# EAGLE design v2.0_r1 (EAGLE 9.6.2)
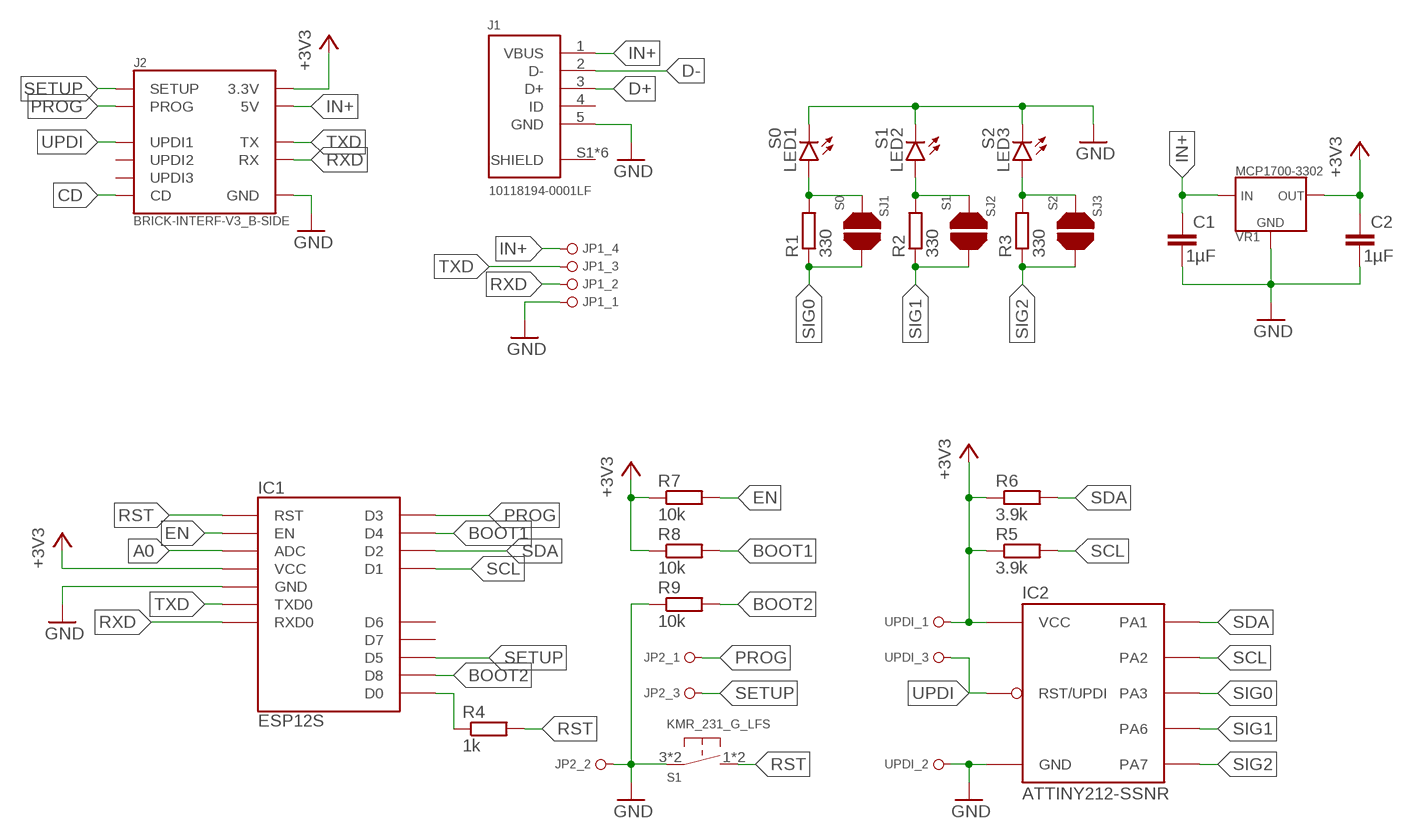
[diagram p0: schematic, sheet 1]

## Parts
C1  1µF  C-EUC0805  [C0805]
C2  1µF  C-EUC0805  [C0805]
IC1  ESP12S  [ESP12S]
IC2  ATTINY212-SSNR  [SOIC8]
J1  10118194-0001LF  [10118194-0001LF]
J2  BRICK-INTERF-V3_B-SIDE  [DF9-11P-1V(32)]
JP1  PINHD_1X04_R_1  [1X04_R_1]
JP2  PINHD_1X03_R_1  [1X03_R_1]
LED1  S0  LED5MM  [LED5MM]
LED2  S1  LED5MM  [LED5MM]
LED3  S2  LED5MM  [LED5MM]
R1  330  R-EU_R0603  [R0603]
R2  330  R-EU_R0603  [R0603]
R3  330  R-EU_R0603  [R0603]
R4  1k  R-EU_R0805  [R0805]
R5  3.9k  R-EU_R0805  [R0805]
R6  3.9k  R-EU_R0805  [R0805]
R7  10k  R-EU_R0805  [R0805]
R8  10k  R-EU_R0805  [R0805]
R9  10k  R-EU_R0805  [R0805]
S1  KMR_231_G_LFS  [KMR_231_G_LFS]
SJ1  S0  SOLDERJUMPER  [SOLDERJUMPER]
SJ2  S1  SOLDERJUMPER  [SOLDERJUMPER]
SJ3  S2  SOLDERJUMPER  [SOLDERJUMPER]
UPDI  PINHD_1X03_R_1  [1X03_R_1]
VR1  MCP1700-3302  [SOT23]

## Nets
+3V3: C2.1 IC1.VCC IC2.1(VCC) J2.10(3.3V) R5.1 R6.1 R7.1 R8.1 UPDI.1 VR1.2(OUT)
A0: IC1.ADC
BOOT1: IC1.GPIO2(D4) R8.2
BOOT2: IC1.GPIO15(D8) R9.2
CD: J2.5(CD)
D+: J1.3(D+)
D-: J1.2(D-)
EN: IC1.EN R7.2
GND: C1.2 C2.2 IC1.GND IC2.8(GND) J1.5(GND) J2.6(GND) JP1.1 JP2.2 LED1.K(C) LED2.K(C) LED3.K(C) R9.1 S1.3 S1.4 UPDI.2 VR1.1(GND)
IN+: C1.1 J1.1(VBUS) J2.4(5V) JP1.4 VR1.3(IN)
N$5: LED1.A R1.2 SJ1.1
N$6: LED2.A R2.2 SJ2.1
N$9: LED3.A R3.2 SJ3.1
PROG: IC1.GPIO0(D3) J2.3(PROG) JP2.1
RST: IC1.RST R4.2 S1.1 S1.2
RXD: IC1.RXD0 J2.11(RX) JP1.2
SCL: IC1.GPIO5(D1) IC2.5(PA2) R5.2
SDA: IC1.GPIO4(D2) IC2.4(PA1) R6.2
SETUP: IC1.GPIO14(D5) J2.2(SETUP) JP2.3
SIG0: IC2.7(PA3) R1.1 SJ1.2
SIG1: IC2.2(PA6) R2.1 SJ2.2
SIG2: IC2.3(PA7) R3.1 SJ3.2
TXD: IC1.TXD0 J2.1(TX) JP1.3
UPDI: IC2.6(RST/UPDI) J2.7(UPDI1) UPDI.3
WAKE: IC1.GPIO16(D0) R4.1
Unconnected: IC1.GPIO12(D6) IC1.GPIO13(D7) J1.4(ID) J2.8(UPDI2) J2.9(UPDI3)

## Power pins joined to a net without a drawn wire
SHIELD: J1.S1(SHIELD) J1.S2(SHIELD) J1.S3(SHIELD) J1.S4(SHIELD) J1.S5(SHIELD) J1.S6(SHIELD)

## Library data of the parts
C1 C2 = rcl:C-EU: CAPACITOR, European symbol; SPICEPREFIX: C
IC1 = no_expressif:ESP12S
IC2 = no_microchip:ATTINY212
J1 = no_reichelt:10118194-0001LF: CONN RCPT USB2.0 MICRO B SMD R/A Manufacturer's datasheet <https://www.amphenol-icc.com/media/wysiwyg/files/drawing/10118194.pdf?__cf_chl_jschl_tk__=1e9b4569481076e99900b246ea640525553a7b60-1588047333-0-AZhEk6D50lwOf6CdaXmV1teudqMKHMxqtb1pEtnUtu77sOc-OVRjbCmHdORomVnr0W49D2E8XkcMdJ2SdWt5rDDYIblyJz7fSv-zilM8vQKAQDC1Z9aMVORhnMgYjPDuz8XpfDLul_eaqqFpemo1xIgoZv50WTuLMwu26ci7e02s9PWvR3z1cDqm9GMGYIPwIUd9yh5-TtN_o6DbEkadC7zoJlhYZSw-VEaYzfWnBSFg_n44fbEB3slHLR2YKLSiTmh8RSwpxKUP4gER0KeVoie9w-Ibtx3oKQbsZjrsPLGSu9BzV2nf3QeoErALCQuycvY9WhQdebLIpxaon6SXufpVIIdoKZHRpjuVVlAkUIr9oSIZGQzzOWY1-dWY48jVEOvnvoxw9-xup5uFcr7XWo0>; CREATED_BY: PCBLayout.com; DIGIKEY_PARTNO: 609-4618-2-ND; MANUFACTURER: Amphenol ICC (FCI); MPN: 10118194-0001LF
J2 = no_brick_interface:BRICK-INTERF-V3
JP1 = no_pinhd:PINHD_1X04; DRILL: 1mm; PADSHAPE: round
JP2 UPDI = no_pinhd:PINHD_1X03; DRILL: 1mm; PADSHAPE: round
LED1-LED3 = led:LED: LED OSRAM: - CHIPLED LG R971, LG N971, LY N971, LG Q971, LY Q971, LO R971, LY R971 LH N974, LH R974 LS Q976, LO Q976, LY Q976 LO Q996 - Hyper CHIPLED LW Q18S LB Q993, LB Q99A, LB R99A - SideLED LS A670, LO A670, LY A670, LG A670, LP A670 LB A673, LV A673, LT A673, LW A673 LH A674 LY A675 LS A676, LA A676, LO A676, LY A676, LW A676 LS A679, LY A679, LG A679 - Hyper Micro SIDELED® LS Y876, LA Y876, LO Y876, LY Y876 LT Y87S - SmartLED LW L88C, LW L88S LB L89C, LB L89S, LG L890 LS L89K, LO L89K, LY L89K LS L896, LA L896, LO L896, LY L896 - TOPLED LS T670, LO T670, LY T670, LG T670, LP T670 LSG T670, LSP T670, LSY T670, LOP T670, LYG T670 LG T671, LOG T671, LSG T671 LB T673, LV T673, LT T673, LW T673 LH T674 LS T676, LA T676, LO T676, LY T676, LB T676, LH T676, LSB T676, LW T676 LB T67C, LV T67C, LT T67C, LS T67K, LO T67K, LY T67K, LW E67C LS E67B, LA E67B, LO E67B, LY E67B, LB E67C, LV E67C, LT E67C LW T67C LS T679, LY T679, LG T679 LS T770, LO T770, LY T770, LG T770, LP T770 LB T773, LV T773, LT T773, LW T773 LH T774 LS E675, LA E675, LY E675, LS T675 LS T776, LA T776, LO T776, LY T776, LB T776 LHGB T686 LT T68C, LB T68C - Hyper Mini TOPLED® LB M676 - Mini TOPLED Santana® LG M470 LS M47K, LO M47K, LY M47K Source: http://www.osram.convergy.de LUXEON: - LUMILED® LXK2-PW12-R00, LXK2-PW12-S00, LXK2-PW14-U00, LXK2-PW14-V00 LXK2-PM12-R00, LXK2-PM12-S00, LXK2-PM14-U00 LXK2-PE12-Q00, LXK2-PE12-R00, LXK2-PE12-S00, LXK2-PE14-T00, LXK2-PE14-U00 LXK2-PB12-K00, LXK2-PB12-L00, LXK2-PB12-M00, LXK2-PB14-N00, LXK2-PB14-P00, LXK2-PB14-Q00 LXK2-PR12-L00, LXK2-PR12-M00, LXK2-PR14-Q00, LXK2-PR14-R00 LXK2-PD12-Q00, LXK2-PD12-R00, LXK2-PD12-S00 LXK2-PH12-R00, LXK2-PH12-S00 LXK2-PL12-P00, LXK2-PL12-Q00, LXK2-PL12-R00 Source: www.luxeon.com KINGBRIGHT: KA-3528ASYC Source: www.kingbright.com
R1-R9 = rcl:R-EU_: RESISTOR, European symbol; SPICEPREFIX: R
S1 = no_reichelt:KMR_231_G_LFS
SJ1-SJ3 = no_pinhd:SOLDERJUMPER
VR1 = no_reichelt:MCP170

## Board
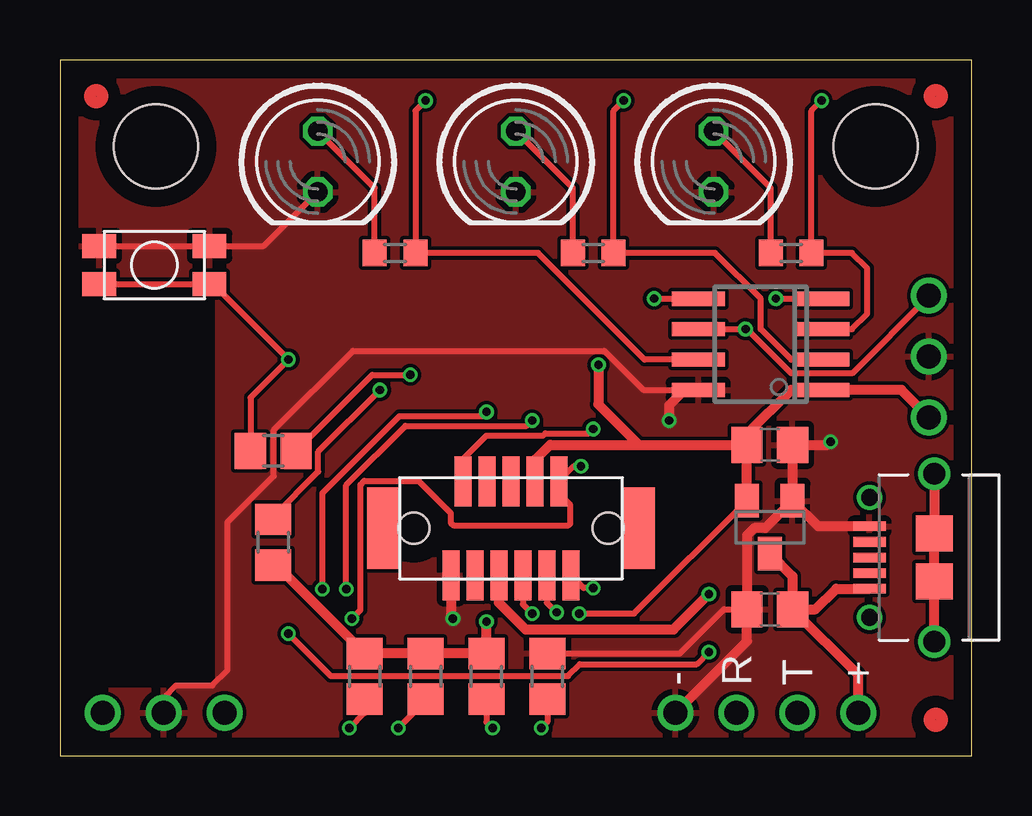
[diagram p1: board, top side]
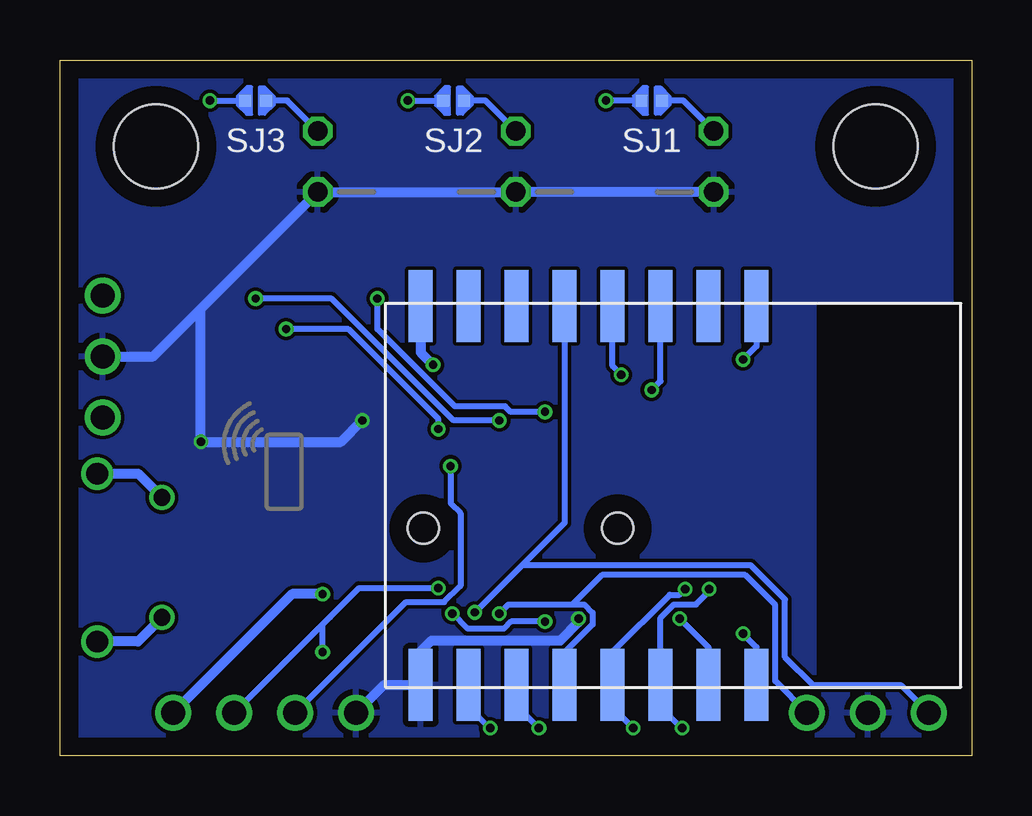
[diagram p2: board, bottom side, seen from below]

Size 38 x 29 mm. Coordinates in mm from the lower left corner, seen from the top.
Outline: 0,0 38,0 38,29 0,29 0,0
Copper layers (1*16): Top 0.035mm / dielectric 1.5mm / Bottom 0.035mm
Design rules "JLCPCB": minimum track width 6mil, minimum drill 0.2mm, track to track 6mil, track to pad 6mil, pad to pad 6mil, via to via 6mil, smd to smd 6mil, copper to edge 30mil, drill to drill 8mil, minimum pad ring 0.13mm, minimum via ring 0.13mm, stop-mask expansion 4mil, vias tented up to drill 0mil, thermal gap 10mil
Holes 3.5 mm at 34,25.4 4,25.4

### Footprints (pad centres in the part's own frame; a part is rotated, then mirrored left to right if it is on the bottom)
C0805 = smd 1.3 x 1.5: 1 -0.95,0; 2 0.95,0
ESP12S = smd 3 x 1: ADC -7.9,1.48; EN -7.9,-0.52; GND 7.9,-10.52; GPIO0 7.9,-4.52; GPIO2 7.9,-6.52; GPIO4 7.9,-2.52; GPIO5 7.9,-0.52; GPIO12 -7.9,-6.52; GPIO13 -7.9,-8.52; GPIO14 -7.9,-4.52; GPIO15 7.9,-8.52; GPIO16 -7.9,-2.52; RST -7.9,3.48; RXD0 7.9,1.48; TXD0 7.9,3.48; VCC -7.9,-10.52
SOIC8 = smd 0.6 x 2.2: 1 -1.905,-2.6; 2 -0.635,-2.6; 3 0.635,-2.6; 4 1.905,-2.6; 5 1.905,2.6; 6 0.635,2.6; 7 -0.635,2.6; 8 -1.905,2.6
10118194-0001LF = smd 0.4 x 1.35: 1 -1.3,2.7; 2 -0.65,2.7; 3 0,2.7; 4 0.65,2.7; 5 1.3,2.7 | drill 0.7: S1 -2.5,2.7; S2 2.5,2.7 | drill 0.9: S3 -3.5,0; S6 3.5,0 | smd 1.5 x 1.55: S4 -1,0; S5 1,0
DF9-11P-1V(32) = smd 0.7 x 2.08: 1 2.5,-1.96; 2 1.5,-1.96; 3 0.5,-1.96; 4 -0.5,-1.96; 5 -1.5,-1.96; 6 -2.5,-1.96; 7 -2,1.96; 8 -1,1.96; 9 0,1.96; 10 1,1.96; 11 2,1.96 | smd 1.3 x 3.4: S1 5.35,0; S2 -5.35,0 | hole 1.3: 4.05,0; -4.05,0
1X04_R_1 = drill 1: 1 -3.81,0; 2 -1.27,0; 3 1.27,0; 4 3.81,0
1X03_R_1 = drill 1: 1 -2.54,0; 2 0,0; 3 2.54,0
LED5MM = drill 0.813 octagon: A -1.27,0; K 1.27,0
R0603 = smd 1 x 1.1: 1 -0.85,0; 2 0.85,0
R0805 = smd 1.3 x 1.5: 1 -0.95,0; 2 0.95,0
KMR_231_G_LFS = smd 1 x 1.4: 1 -0.8,2.3; 2 -0.8,-2.3; 3 0.8,-2.3; 4 0.8,2.3
SOLDERJUMPER = smd 0.508 x 0.508: 1 -0.432,0; 2 0.432,0
SOT23 = smd 1 x 1.4: 1 -0.95,-1.1; 2 0.95,-1.1; 3 0,1.1

### Placement (x,y rotation side)
C1  29.59,6.1 180 top
C2  29.59,12.95 0 top
FD1  [FIDUCIAL]  1.5,27.5 0 top
FD2  [FIDUCIAL]  36.5,27.5 0 top
FD3  [FIDUCIAL]  36.5,1.5 0 top
IC1  12.45,10.85 270 bottom
IC2  29.21,17.14 90 top
J1  36.45,8.26 90 top
J2  18.8,9.47 0 top
JP1  29.46,1.78 0 top
JP2  4.32,1.78 180 top
LED1  10.74,24.77 270 top
LED2  19,24.77 270 top
LED3  27.25,24.77 270 top
R1  13.97,20.95 180 top
R2  22.23,20.95 180 top
R3  30.48,20.95 180 top
R4  8.89,12.7 180 top
R5  12.7,3.3 270 top
R6  15.24,3.3 270 top
R7  8.89,8.89 90 top
R8  17.78,3.3 270 top
R9  20.32,3.3 270 top
S1  3.94,20.45 90 top
SJ1  13.34,27.3 180 bottom
SJ2  21.59,27.3 180 bottom
SJ3  29.84,27.3 180 bottom
U$3  [BRICKS_LOGO_10]  26.04,6.73 90 bottom
UPDI  36.22,16.64 90 top
VR1  29.59,9.53 180 top

### Tracks (layer width: path | path; a pad name or v marks a point on that pad's centre or on a via)
+3V3  (via drill 0.35)
  Top 0.254: v21.64,5.92 23.93,5.92 VR1.2
  Top 0.406: VR1.2 C2.1 | C2.1 28.64,13.4 30.48,15.24 IC2.1 35.08,15.24 UPDI.1 | R7.1 9.01,7.94 R5.1 R6.1 R8.1 v17.78,5.59 | J2.10 19.8,12.33 20.43,12.95 24.13,12.95 | 24.13,12.95 C2.1 | v22.45,16.29 22.45,14.64 24.13,12.95
  Bottom 0.254: v17.78,5.59 19.19,5.59 19.49,5.28 21,5.28 v21.64,5.92
  Bottom 0.406: IC1.VCC 22.96,16.81 v22.45,16.29
BOOT1  (via drill 0.35)
  Top 0.254: R8.2 17.78,1.4 v18.03,1.14
  Bottom 0.254: IC1.GPIO2 18.96,2.07 v18.03,1.14
BOOT2  (via drill 0.35)
  Top 0.254: R9.2 20.32,1.4 v20.07,1.14
  Bottom 0.254: IC1.GPIO15 20.96,2.04 v20.07,1.14
EN  (via drill 0.35)
  Top 0.254: v13.34,15.24 10.77,12.67 10.77,11.83 8.89,9.96 R7.2
  Bottom 0.254: v13.34,15.24 12.96,15.61 IC1.EN
GND  (via drill 0.35)
  Top 0.254: S1.4 S1.3 8.5,21.25 LED1.K | JP2.2 4.32,2.41 4.83,2.92 6.35,2.92 6.99,3.56 6.99,9.73 8.91,11.66 8.91,13.57 12.22,16.87 22.69,16.87 24.32,15.24 26.04,15.24 | R9.1 25.84,4.25 27.69,6.1 C1.2
  Top 0.406: VR1.1 C2.2 32,12.95 v32.13,13.08 | VR1.1 29.4,9.48 28.94,9.48 28.64,9.18 C1.2 28.64,4.76 JP1.1 | J1.5 31.61,9.55 VR1.1 | J2.6 16.3,5.8 v16.38,5.71 | v25.4,13.97 25.4,14.61 26.04,15.24 IC2.8
  Bottom 0.406: LED1.K LED2.K LED3.K 32.13,18.62 | JP1.1 24.49,2.94 IC1.GND 22.96,4.34 22.5,4.8 21.61,4.8 21.59,4.8 17.14,4.8 16.38,5.56 v16.38,5.71 | UPDI.2 34.11,16.64 32.13,18.62 | 32.13,18.62 v32.13,13.08 26.29,13.08 v25.4,13.97
  pour Top: 0,0 38,0 38,29 0,29
  pour Bottom: 0,0 38,0 38,29 0,29
IN+  (via drill 0.35)
  Top 0.406: VR1.3 30.54,7.47 C1.1 | JP1.4 33.27,3.36 C1.1 | v27.05,6.73 25.58,5.26 19.41,5.26 18.3,6.37 J2.4 | C1.1 31.5,6.1 32.35,6.96 J1.1
  Bottom 0.406: v27.05,6.73 28.32,6.73 JP1.4
N$5
  Top 0.254: R1.2 13.12,23.66 LED1.A
  Bottom 0.254: LED1.A 12.02,27.3 SJ1.1
N$6
  Top 0.254: R2.2 21.38,23.66 LED2.A
  Bottom 0.254: LED2.A 20.27,27.3 SJ2.1
N$9
  Top 0.254: R3.2 29.63,23.66 LED3.A
  Bottom 0.254: LED3.A 28.52,27.3 SJ3.1
PROG  (via drill 0.35)
  Top 0.254: J2.3 19.3,6.3 v19.68,5.92
  Bottom 0.254: 16.62,6.3 16.14,6.3 15.8,5.96 15.8,5.46 16.96,4.3 IC1.GPIO0 | JP2.1 8.19,3.11 8.19,6.28 9.43,7.53 15.4,7.53 16.62,6.3 | v19.68,5.92 19.3,6.3 16.62,6.3
RST  (via drill 0.35)
  Top 0.254: R4.2 7.94,14.93 v9.53,16.51 6.39,19.65 S1.2 S1.1
  Bottom 0.254: IC1.RST 8.96,17.07 v9.53,16.51
RXD  (via drill 0.35)
  Top 0.254: v12.17,5.71 12.52,6.07 12.52,11.29 12.69,11.45 14.95,11.45 16.29,10.11 16.29,9.7 16.4,9.6 21.2,9.6 21.28,9.67 21.28,10.45 20.8,10.92 J2.11 21.43,12.06 v21.72,12.06
  Bottom 0.254: JP1.2 23.57,6.4 21.98,6.4 21.31,7.07 21.31,10.11 21.72,10.52 v21.72,12.06 | IC1.RXD0 10.96,4.51 v12.17,5.71
SCL  (via drill 0.35)
  Top 0.254: R5.2 12.7,1.78 v12.06,1.14 | v10.94,6.94 10.94,10.94 14.15,14.15 17.6,14.15 v17.78,14.33 | v24.77,19.05 IC2.5
  Bottom 0.254: v12.06,1.14 12.96,2.04 IC1.GPIO5 12.96,5.75 12.41,6.3 11.48,6.3 10.94,6.84 v10.94,6.94 | v17.78,14.33 19.21,14.33 19.44,14.55 21.54,14.55 24.77,17.78 v24.77,19.05
SDA  (via drill 0.35)
  Top 0.254: R6.2 15.24,2.29 v14.1,1.14 | v19.68,13.97 19.46,13.74 14.4,13.74 11.94,11.28 v11.94,6.94 | v29.84,19.05 IC2.4
  Bottom 0.254: v14.1,1.14 14.96,2.01 IC1.GPIO4 14.96,4.32 12.58,6.71 12.18,6.71 v11.94,6.94 | v19.68,13.97 21.59,13.97 26.67,19.05 v29.84,19.05
SETUP  (via drill 0.35)
  Top 0.254: J2.2 20.3,6.37 v20.7,5.97
  Bottom 0.254: JP2.3 2.92,2.92 6.6,2.92 7.78,4.1 7.78,6.51 9.2,7.93 18.74,7.93 | 18.74,7.93 v20.7,5.97 | 18.74,7.93 16.96,9.71 IC1.GPIO14
SHIELD
  Top 0.406: J1.S6 J1.S5 J1.S4 J1.S3
  Bottom 0.406: J1.S1 34.75,4.75 J1.S3 | J1.S6 34.75,11.76 J1.S2
SIG0  (via drill 0.35)
  Top 0.254: v15.24,27.3 14.82,26.89 R1.1 19.93,20.95 24.38,16.51 IC2.7
  Bottom 0.254: SJ1.2 v15.24,27.3
SIG1  (via drill 0.35)
  Top 0.254: v23.5,27.3 23.07,26.89 R2.1 27.3,20.95 29.21,19.05 29.21,17.78 30.48,16.51 IC2.2
  Bottom 0.254: v23.5,27.3 SJ2.2
SIG2  (via drill 0.35)
  Top 0.254: v31.75,27.3 31.33,26.89 R3.1 33.02,20.95 33.66,20.32 33.66,18.41 33.02,17.78 IC2.3
  Bottom 0.254: v31.75,27.3 SJ3.2
TXD  (via drill 0.35)
  Top 0.254: v22.23,6.99 21.83,6.99 J2.1 | v9.53,5.08 11.28,3.32 21.19,3.32 21.67,3.81 26.54,3.81 v27.05,4.32
  Bottom 0.254: JP1.3 27.05,5.46 | v22.23,6.99 25.53,6.99 26.73,5.78 27.05,5.46 | IC1.TXD0 8.96,4.51 v9.53,5.08 | v27.05,4.32 27.05,5.46
UPDI  (via drill 0.35)
  Top 0.254: IC2.6 v28.57,17.78 28.64,17.78 30.48,15.93 33.03,15.93 36.22,19.12 UPDI.3 | J2.7 16.8,12.36 17.78,13.34 20.13,13.34 20.23,13.44 22.05,13.44 v22.23,13.62
  Bottom 0.254: v22.23,13.62 22.23,14.03 25.98,17.78 v28.57,17.78
WAKE  (via drill 0.35)
  Top 0.254: R4.1 13.02,15.88 v14.61,15.88
  Bottom 0.254: v14.61,15.88 14.96,16.23 IC1.GPIO16

### Text on the board
tNames: - | R | T | +
tDocu: RST | U | NAHS-SignalBrick | G | v2.0 R1 | by NiJO's | 3V3 | B-Int | v3.0 | SETUP | GND | PROG
bDocu: S0 | S1 | S2 | GND | GND | UPDI | GND | 3V3 | IN- | RXD | TXD | IN+